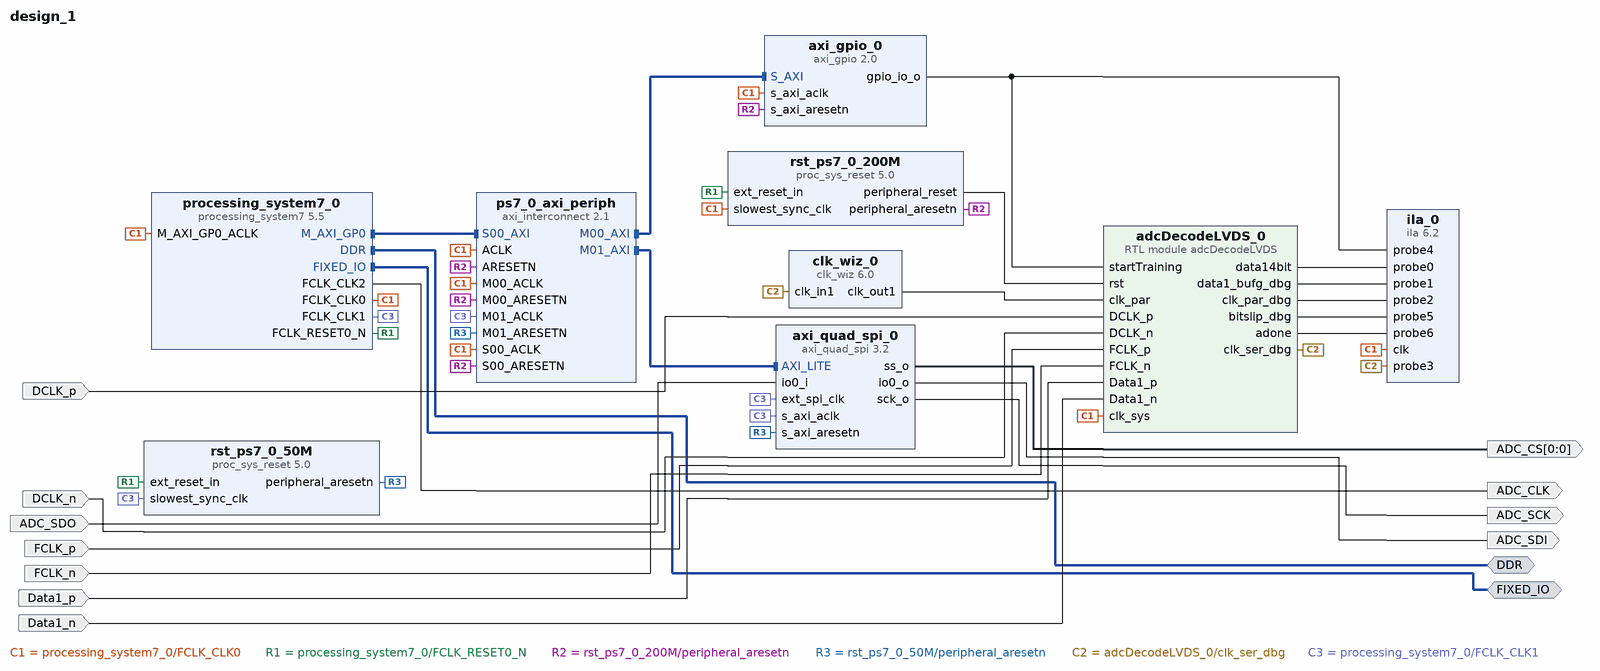
[diagram p0: block diagram of the top level]
# Vivado block design design_1, xc7z010clg400-1, Vivado 2020.1
create_bd_design design_1

create_bd_intf_port -mode Master -vlnv xilinx.com:interface:ddrx_rtl:1.0 DDR
create_bd_intf_port -mode Master -vlnv xilinx.com:display_processing_system7:fixedio_rtl:1.0 FIXED_IO
create_bd_port -dir I DCLK_p
create_bd_port -dir I DCLK_n
create_bd_port -dir I FCLK_p
create_bd_port -dir I FCLK_n
create_bd_port -dir I Data1_p
create_bd_port -dir I Data1_n
create_bd_port -dir O ADC_SDI
create_bd_port -dir O ADC_SCK
create_bd_port -dir O -from 0 -to 0 ADC_CS
create_bd_port -dir I ADC_SDO
create_bd_port -dir O -type clk ADC_CLK
set_property -dict {CONFIG.FREQ_HZ 5000000} [get_bd_ports ADC_CLK]

create_bd_cell -type ip -vlnv xilinx.com:ip:processing_system7:5.5 processing_system7_0
set_property -dict [list \
  CONFIG.PCW_APU_PERIPHERAL_FREQMHZ 666.666666 \
  CONFIG.PCW_ENET0_PERIPHERAL_ENABLE 0 \
  CONFIG.PCW_EN_CLK1_PORT 1 \
  CONFIG.PCW_EN_CLK2_PORT 1 \
  CONFIG.PCW_FCLK_CLK1_BUF TRUE \
  CONFIG.PCW_FCLK_CLK2_BUF TRUE \
  CONFIG.PCW_FPGA0_PERIPHERAL_FREQMHZ 200 \
  CONFIG.PCW_FPGA1_PERIPHERAL_FREQMHZ 10 \
  CONFIG.PCW_FPGA2_PERIPHERAL_FREQMHZ 5 \
  CONFIG.PCW_FPGA_FCLK1_ENABLE 1 \
  CONFIG.PCW_FPGA_FCLK2_ENABLE 1 \
  CONFIG.PCW_GPIO_MIO_GPIO_ENABLE 0 \
  CONFIG.PCW_PERIPHERAL_BOARD_PRESET None \
  CONFIG.PCW_PRESET_BANK1_VOLTAGE {LVCMOS 1.8V} \
  CONFIG.PCW_QSPI_PERIPHERAL_ENABLE 0 \
  CONFIG.PCW_SD0_PERIPHERAL_ENABLE 0 \
  CONFIG.PCW_UART0_PERIPHERAL_ENABLE 1 \
  CONFIG.PCW_UART0_UART0_IO {MIO 14 .. 15} \
  CONFIG.PCW_UART1_PERIPHERAL_ENABLE 0 \
  CONFIG.PCW_UART_PERIPHERAL_FREQMHZ 100 \
  CONFIG.PCW_UIPARAM_DDR_FREQ_MHZ 533.333333 \
  CONFIG.PCW_UIPARAM_DDR_PARTNO {MT41J128M16 HA-125} \
  CONFIG.PCW_USB0_PERIPHERAL_ENABLE 0 \
] [get_bd_cells processing_system7_0]
# 335 more settings of processing_system7_0 are not shown: defaults, MIO pin electricals, DDR timing, and values the tool derives
create_bd_cell -type ip -vlnv xilinx.com:ip:axi_gpio:2.0 axi_gpio_0
set_property -dict {CONFIG.C_ALL_OUTPUTS 1 CONFIG.C_GPIO_WIDTH 1} [get_bd_cells axi_gpio_0]
create_bd_cell -type ip -vlnv xilinx.com:ip:axi_interconnect:2.1 ps7_0_axi_periph
set_property -dict {CONFIG.NUM_MI 2} [get_bd_cells ps7_0_axi_periph]
create_bd_cell -type ip -vlnv xilinx.com:ip:proc_sys_reset:5.0 rst_ps7_0_200M
create_bd_cell -type ip -vlnv xilinx.com:ip:ila:6.2 ila_0
set_property -dict [list \
  CONFIG.C_DATA_DEPTH 16384 \
  CONFIG.C_ENABLE_ILA_AXI_MON false \
  CONFIG.C_MONITOR_TYPE Native \
  CONFIG.C_NUM_OF_PROBES 7 \
  CONFIG.C_PROBE0_WIDTH 14 \
  CONFIG.C_PROBE1_WIDTH 2 \
] [get_bd_cells ila_0]
create_bd_cell -type ip -vlnv xilinx.com:ip:axi_quad_spi:3.2 axi_quad_spi_0
set_property -dict {CONFIG.C_NUM_TRANSFER_BITS 8 CONFIG.C_SCK_RATIO 2 CONFIG.C_USE_STARTUP 0} [get_bd_cells axi_quad_spi_0]
create_bd_cell -type ip -vlnv xilinx.com:ip:proc_sys_reset:5.0 rst_ps7_0_50M
create_bd_cell -type ip -vlnv xilinx.com:ip:clk_wiz:6.0 clk_wiz_0
set_property -dict [list \
  CONFIG.CLKOUT1_JITTER 631.442 \
  CONFIG.CLKOUT1_PHASE_ERROR 346.848 \
  CONFIG.CLKOUT1_REQUESTED_OUT_FREQ 5 \
  CONFIG.MMCM_CLKFBOUT_MULT_F 32.000 \
  CONFIG.MMCM_CLKOUT0_DIVIDE_F 128.000 \
  CONFIG.MMCM_DIVCLK_DIVIDE 5 \
  CONFIG.USE_LOCKED false \
  CONFIG.USE_RESET false \
] [get_bd_cells clk_wiz_0]
create_bd_cell -type module -reference adcDecodeLVDS adcDecodeLVDS_0

# ---- connections ----

connect_bd_intf_net [get_bd_intf_pins processing_system7_0/M_AXI_GP0] [get_bd_intf_pins ps7_0_axi_periph/S00_AXI]
connect_bd_intf_net [get_bd_intf_ports DDR] [get_bd_intf_pins processing_system7_0/DDR]
connect_bd_intf_net [get_bd_intf_pins ps7_0_axi_periph/M01_AXI] [get_bd_intf_pins axi_quad_spi_0/AXI_LITE]
connect_bd_intf_net [get_bd_intf_pins ps7_0_axi_periph/M00_AXI] [get_bd_intf_pins axi_gpio_0/S_AXI]
connect_bd_intf_net [get_bd_intf_ports FIXED_IO] [get_bd_intf_pins processing_system7_0/FIXED_IO]
connect_bd_net -net DCLK_p_0_1 [get_bd_ports DCLK_p] [get_bd_pins adcDecodeLVDS_0/DCLK_p]
connect_bd_net -net DCLK_n_0_1 [get_bd_ports DCLK_n] [get_bd_pins adcDecodeLVDS_0/DCLK_n]
connect_bd_net -net FCLK_p_0_1 [get_bd_ports FCLK_p] [get_bd_pins adcDecodeLVDS_0/FCLK_p]
connect_bd_net -net FCLK_n_0_1 [get_bd_ports FCLK_n] [get_bd_pins adcDecodeLVDS_0/FCLK_n]
connect_bd_net -net Data1_p_0_1 [get_bd_ports Data1_p] [get_bd_pins adcDecodeLVDS_0/Data1_p]
connect_bd_net -net Data1_n_0_1 [get_bd_ports Data1_n] [get_bd_pins adcDecodeLVDS_0/Data1_n]
connect_bd_net [get_bd_pins processing_system7_0/FCLK_CLK0] \
  [get_bd_pins processing_system7_0/M_AXI_GP0_ACLK] [get_bd_pins ps7_0_axi_periph/S00_ACLK] \
  [get_bd_pins rst_ps7_0_200M/slowest_sync_clk] [get_bd_pins axi_gpio_0/s_axi_aclk] [get_bd_pins ps7_0_axi_periph/M00_ACLK] \
  [get_bd_pins ps7_0_axi_periph/ACLK] [get_bd_pins ila_0/clk] [get_bd_pins adcDecodeLVDS_0/clk_sys]
connect_bd_net [get_bd_pins processing_system7_0/FCLK_RESET0_N] [get_bd_pins rst_ps7_0_200M/ext_reset_in] [get_bd_pins rst_ps7_0_50M/ext_reset_in]
connect_bd_net [get_bd_pins rst_ps7_0_200M/peripheral_aresetn] \
  [get_bd_pins ps7_0_axi_periph/S00_ARESETN] [get_bd_pins axi_gpio_0/s_axi_aresetn] \
  [get_bd_pins ps7_0_axi_periph/M00_ARESETN] [get_bd_pins ps7_0_axi_periph/ARESETN]
connect_bd_net [get_bd_pins axi_gpio_0/gpio_io_o] [get_bd_pins ila_0/probe4] [get_bd_pins adcDecodeLVDS_0/startTraining]
connect_bd_net [get_bd_pins adcDecodeLVDS_0/data14bit] [get_bd_pins ila_0/probe0]
connect_bd_net [get_bd_pins rst_ps7_0_50M/peripheral_aresetn] [get_bd_pins axi_quad_spi_0/s_axi_aresetn] [get_bd_pins ps7_0_axi_periph/M01_ARESETN]
connect_bd_net [get_bd_pins axi_quad_spi_0/io0_o] [get_bd_ports ADC_SDI]
connect_bd_net [get_bd_pins axi_quad_spi_0/sck_o] [get_bd_ports ADC_SCK]
connect_bd_net [get_bd_pins axi_quad_spi_0/ss_o] [get_bd_ports ADC_CS]
connect_bd_net -net io0_i_0_1 [get_bd_ports ADC_SDO] [get_bd_pins axi_quad_spi_0/io0_i]
connect_bd_net [get_bd_pins rst_ps7_0_200M/peripheral_reset] [get_bd_pins adcDecodeLVDS_0/rst]
connect_bd_net [get_bd_pins adcDecodeLVDS_0/data1_bufg_dbg] [get_bd_pins ila_0/probe1]
connect_bd_net [get_bd_pins adcDecodeLVDS_0/clk_par_dbg] [get_bd_pins ila_0/probe2]
connect_bd_net [get_bd_pins processing_system7_0/FCLK_CLK2] [get_bd_ports ADC_CLK]
connect_bd_net [get_bd_pins adcDecodeLVDS_0/clk_ser_dbg] [get_bd_pins ila_0/probe3] [get_bd_pins clk_wiz_0/clk_in1]
connect_bd_net -net M01_ACLK_1 [get_bd_pins processing_system7_0/FCLK_CLK1] \
  [get_bd_pins ps7_0_axi_periph/M01_ACLK] [get_bd_pins rst_ps7_0_50M/slowest_sync_clk] \
  [get_bd_pins axi_quad_spi_0/ext_spi_clk] [get_bd_pins axi_quad_spi_0/s_axi_aclk]
connect_bd_net [get_bd_pins adcDecodeLVDS_0/bitslip_dbg] [get_bd_pins ila_0/probe5]
connect_bd_net [get_bd_pins adcDecodeLVDS_0/adone] [get_bd_pins ila_0/probe6]
connect_bd_net [get_bd_pins clk_wiz_0/clk_out1] [get_bd_pins adcDecodeLVDS_0/clk_par]

# ---- address map ----
assign_bd_address -offset 0x41200000 -range 64K -target_address_space [get_bd_addr_spaces processing_system7_0/Data] [get_bd_addr_segs axi_gpio_0/S_AXI/Reg]
assign_bd_address -offset 0x41E00000 -range 64K -target_address_space [get_bd_addr_spaces processing_system7_0/Data] [get_bd_addr_segs axi_quad_spi_0/AXI_LITE/Reg]

validate_bd_design
save_bd_design
